# EAGLE design Rear CAN Backplane (EAGLE 5.12)
PARTNO: 43045-0218
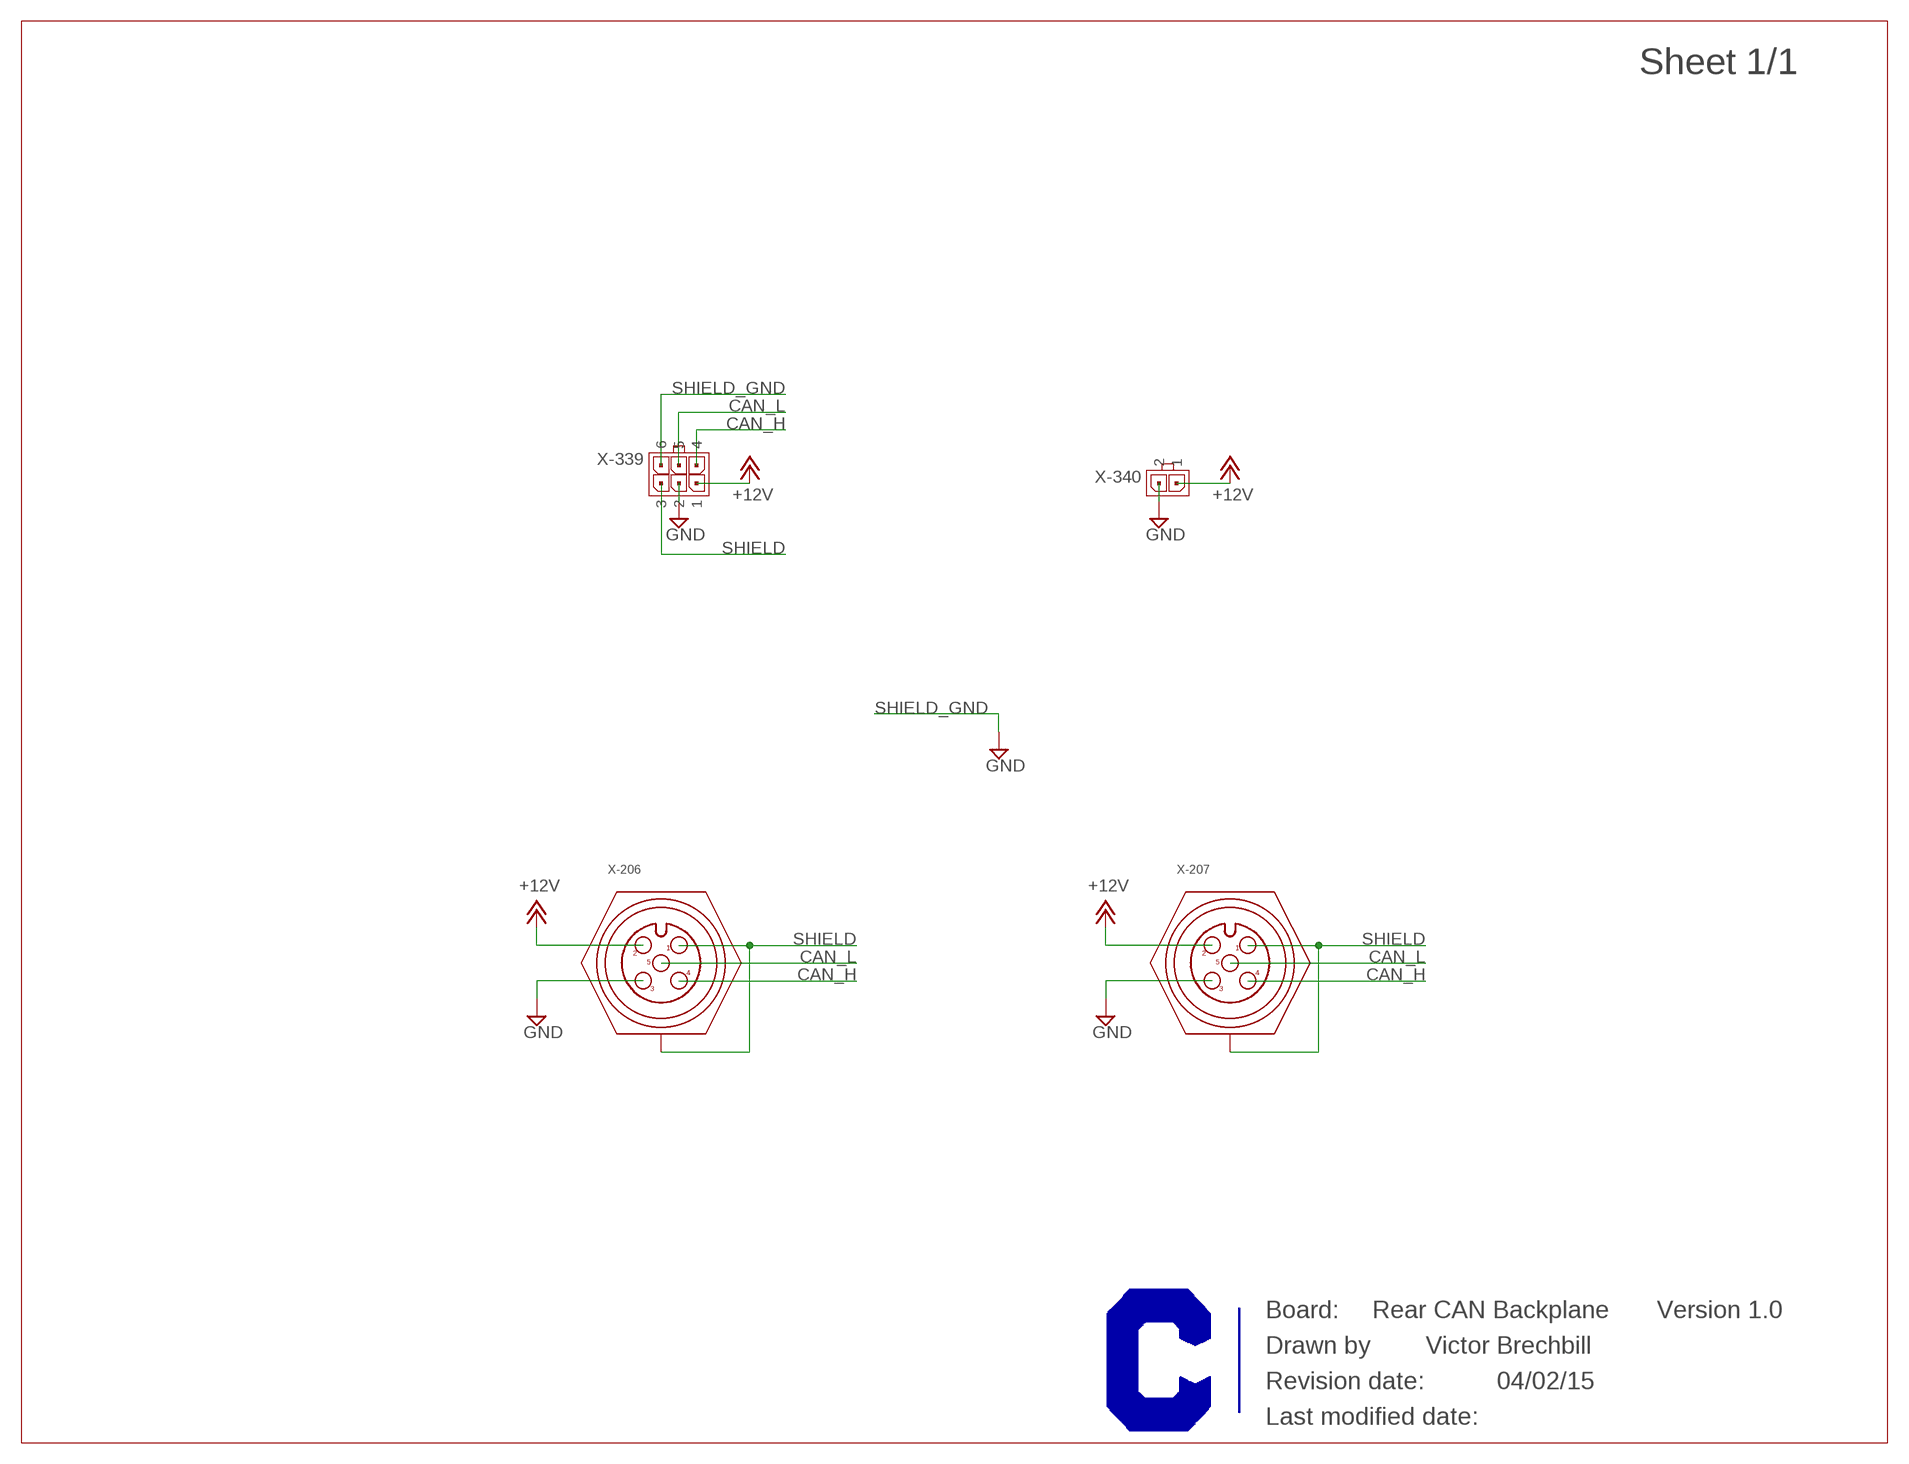
[diagram p0: schematic, sheet 1]

## Parts
U$1  CURRENT-C-LETTER-LANDSCAPE  [BLANK]
X-206  M12-5-VERT-PCB-MALE  [M12-VERT-PCB]
X-207  M12-5-VERT-PCB-MALE  [M12-VERT-PCB]
X-339  MICROFIT-06-DUAL-VERT-SMD-CLIP_RETENTION  [MICROFIT-6-VERT-SMD-CLIP_RETENTION]
X-340  MICROFIT-02-SINGLE-VERT-SMD  [MICROFIT-2-SINGLE-VERT-SMD]

## Nets
+12V: X-206.2 X-207.2 X-339.1 X-340.1
CAN_H: X-206.4 X-207.4 X-339.4
CAN_L: X-206.5 X-207.5 X-339.5
GND: X-206.3 X-207.3 X-339.2 X-339.6 X-340.2
SHIELD: X-206.1 X-206.SHIELD X-207.1 X-207.SHIELD X-339.3

## Notes on the sheet
- SHIELD_GND
- SHIELD_GND
- Rear CAN Backplane | Version 1.0
- Victor Brechbill
- 04/02/15

## Library data of the parts
U$1 = Frames:CURRENT-C-LETTER-LANDSCAPE; BOM: EXCLUDE
X-206 X-207 = Conec:M12-5: http://media.digikey.com/pdf/Data%20Sheets/Conec%20PDFs/43-01208-11_Dwg.pdf; PARTNO: 43-01169
X-339 = Molex:MICROFIT-06-DUAL: Molex MicroFit 3.00mm Pitch Header, Surface Mount, Dual Row, 6 Circuits Note, November 2014: These come in three styles: Through-hole, with metal clip retention to PCB (not currently represented) (cheapest) SMD, with solder tab retention (-SMD) (more expensive, commonly stocked) SMD, with metal clip retention (-SMD-CLIP_RETENTION) (most expensive, not often stocked) Please use them in that order! Drawing: http://www.molex.com/pdm_docs/sd/430450609_sd.pdf (right-angle) Information: http://www.molex.com/molex/products/datasheet.jsp?part=active/0430450618_PCB_HEADERS.xml
X-340 = Molex:MICROFIT-02-SINGLE: Molex MicroFit 3.00mm Pitch Header, Surface Mount, Dual Row, 4 Circuits Molex P/N: 43650-0212 (RA) Drawing: http://www.molex.com/pdm_docs/sd/436500212_sd.pdf (RA)

## Board
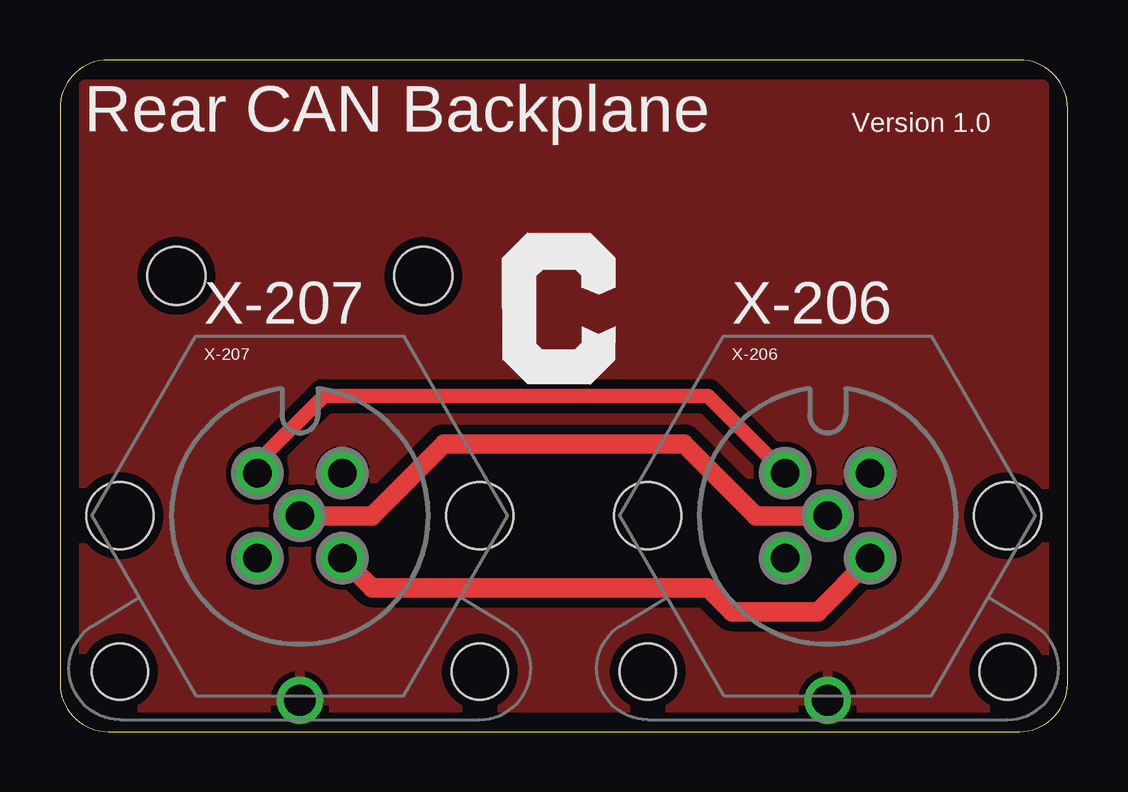
[diagram p1: board, top side]
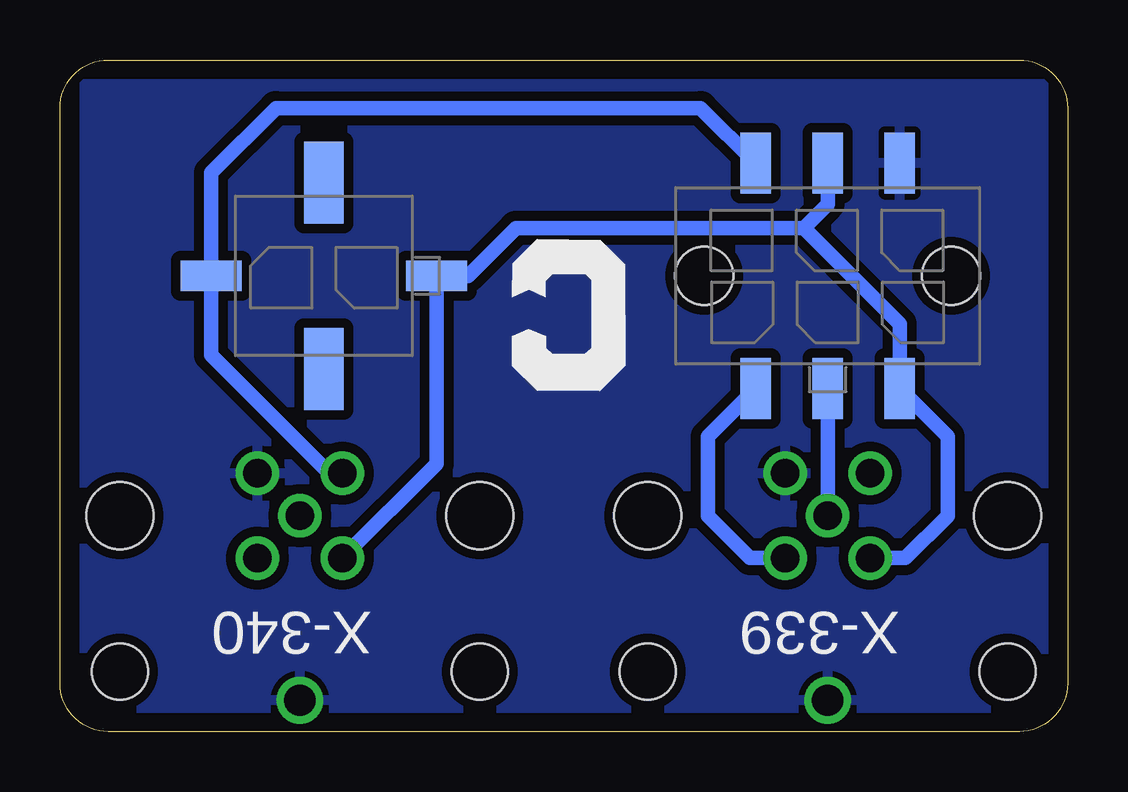
[diagram p2: board, bottom side, seen from below]

Size 42 x 28 mm. Coordinates in mm from the lower left corner, seen from the top.
Outline: 40,0 arc90 42,2 42,26 arc90 40,28 2,28 arc90 0,26 0,2 arc90 2,0 40,0
Copper layers (1*16): Top 0.0356mm / dielectric 1.5011mm / Bottom 0.0356mm
Design rules "OSH Park 2-layer": minimum track width 6mil, minimum drill 13mil, track to track 6mil, track to pad 6mil, pad to pad 6mil, via to via 6mil, smd to smd 6mil, copper to edge 15mil, drill to drill 6mil, minimum pad ring 7mil, minimum via ring 7mil, stop-mask expansion 4mil, vias tented up to drill 0mil, thermal gap 10mil

### Footprints (pad centres in the part's own frame; a part is rotated, then mirrored left to right if it is on the bottom)
M12-VERT-PCB = drill 1.2 round: 1 1.768,1.768; 2 -1.768,1.768; 3 -1.768,-1.768; 4 1.768,-1.768; 5 0,0 | drill 1.3 round: SHIELD 0,-7.7 | hole 2.8: 7.5,0; -7.5,0 | hole 2.35: 7.5,-6.5; -7.5,-6.5
MICROFIT-6-VERT-SMD-CLIP_RETENTION = smd 1.27 x 2.54: 1 3,-4.699; 2 0,-4.699; 3 -3,-4.699; 4 3,4.699; 5 0,4.699; 6 -3,4.699 | hole 2.41: 5.15,0; -5.15,0
MICROFIT-2-SINGLE-VERT-SMD = smd 1.27 x 2.54: 1 0,-4.7; 2 0,4.7 | smd 3.43 x 1.65: 5 3.885,0; 6 -3.885,0

### Placement (x,y rotation side)
U$1  -13.97,52.07 0 top  (outside the outline)
X-206  32,9 0 top
X-207  10,9 0 top
X-339  10,19 180 bottom
X-340  31,19 270 bottom

### Tracks (layer width: path | path; a pad name or v marks a point on that pad's centre or on a via)
+12V
  Top 0.61: X-207.2 8.23,11.23 11,14 27,14 X-206.2
  Bottom 0.61: X-339.1 15.3,26 33,26 35.7,23.3 X-340.1 35.7,15.7 30.77,10.77 X-206.2
CAN_H
  Top 0.813: X-207.4 13,6 27,6 28,5 31.6,5 33.77,7.17 X-206.4
  Bottom 0.61: X-339.4 15,12.3 15,9 13.23,7.23 X-207.4
CAN_L
  Top 0.813: X-207.5 13,9 16,12 26,12 29,9 X-206.5
  Bottom 0.61: X-207.5 X-339.5
GND
  Bottom 0.61: X-339.6 5,12.3 5,9 6.77,7.23 X-207.3 | X-206.3 26.3,11.16 X-340.2 25,19 23,21 11,21 | X-339.6 7,15 | 11,21 10,22 X-339.2 | 11,21 7,17 X-339.6
SHIELD
  pour Bottom (isolate 0.406): 1,27 41,27 41,1 1,1 1,3
  pour Top (isolate 0.406): 1,27 41,27 41,1 1,1

### Text on the board
_tsilk: Rear CAN Backplane | Version 1.0 | X-207 | X-206
_bsilk: X-339 | X-340